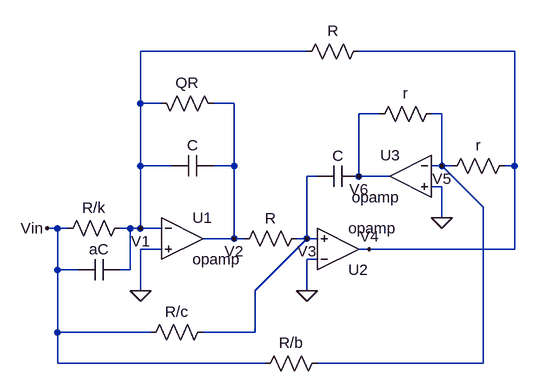
[diagram p0: schematic Ackberg_Mossberg _modificada.asc]
Ackberg_Mossberg _modificada.asc, the LTspice schematic file:
Version 4
SHEET 1 880 680
WIRE 304 -64 48 -64
WIRE 624 -64 384 -64
WIRE 48 16 48 -64
WIRE 80 16 48 16
WIRE 192 16 160 16
WIRE 416 32 384 32
WIRE 512 32 496 32
WIRE 48 112 48 16
WIRE 96 112 48 112
WIRE 192 112 192 16
WIRE 192 112 160 112
WIRE 512 112 512 32
WIRE 512 112 496 112
WIRE 528 112 512 112
WIRE 624 112 624 -64
WIRE 624 112 608 112
WIRE 320 128 304 128
WIRE 384 128 384 32
WIRE 432 128 384 128
WIRE 512 144 496 144
WIRE 576 176 512 112
WIRE 512 192 512 144
WIRE -80 208 -96 208
WIRE -64 208 -80 208
WIRE 32 208 16 208
WIRE 48 208 48 112
WIRE 48 208 32 208
WIRE 80 208 48 208
WIRE 192 224 192 112
WIRE 192 224 144 224
WIRE 208 224 192 224
WIRE 304 224 304 128
WIRE 304 224 288 224
WIRE 320 224 304 224
WIRE 80 240 48 240
WIRE 400 240 384 240
WIRE 624 240 624 112
WIRE 624 240 400 240
WIRE 320 256 304 256
WIRE -80 272 -80 208
WIRE -48 272 -80 272
WIRE 32 272 32 208
WIRE 32 272 16 272
WIRE 48 304 48 240
WIRE 224 304 304 224
WIRE 304 304 304 256
WIRE -80 368 -80 272
WIRE 64 368 -80 368
WIRE 224 368 224 304
WIRE 224 368 144 368
WIRE -80 416 -80 368
WIRE 240 416 -80 416
WIRE 576 416 576 176
WIRE 576 416 320 416
FLAG 304 304 0
FLAG 48 304 0
FLAG -96 208 Vin
FLAG 48 208 V1
FLAG 192 224 V2
FLAG 304 224 V3
FLAG 400 240 V4
FLAG 512 192 0
FLAG 512 112 V5
FLAG 384 128 V6
SYMBOL res 32 192 R90
WINDOW 0 0 56 VBottom 2
WINDOW 3 32 56 VTop 2
SYMATTR InstName R/k
SYMATTR Value ""
SYMBOL Opamps\\opamp 112 160 R0
SYMATTR InstName U1
SYMBOL res 64 0 M90
WINDOW 0 0 56 VBottom 2
WINDOW 3 32 56 VTop 2
SYMATTR InstName QR
SYMATTR Value ""
SYMBOL cap 96 96 M90
WINDOW 0 0 32 VBottom 2
WINDOW 3 32 32 VTop 2
SYMATTR InstName C
SYMATTR Value ""
SYMBOL res 304 208 R90
WINDOW 0 0 56 VBottom 2
WINDOW 3 32 56 VTop 2
SYMATTR InstName R
SYMATTR Value ""
SYMBOL Opamps\\opamp 352 304 M180
SYMATTR InstName U2
SYMBOL cap 384 112 R90
WINDOW 0 0 32 VBottom 2
WINDOW 3 32 32 VTop 2
SYMATTR InstName C
SYMATTR Value ""
SYMBOL res 400 -80 R90
WINDOW 0 0 56 VBottom 2
WINDOW 3 32 56 VTop 2
SYMATTR InstName R
SYMATTR Value ""
SYMBOL Opamps\\opamp 464 64 M0
SYMATTR InstName U3
SYMBOL res 624 96 R90
WINDOW 0 0 56 VBottom 2
WINDOW 3 32 56 VTop 2
SYMATTR InstName r
SYMATTR Value ""
SYMBOL res 512 16 R90
WINDOW 0 0 56 VBottom 2
WINDOW 3 32 56 VTop 2
SYMATTR InstName r
SYMATTR Value ""
SYMBOL cap 16 256 R90
WINDOW 0 0 32 VBottom 2
WINDOW 3 28 32 VBottom 2
SYMATTR InstName aC
SYMATTR Value ""
SYMBOL res 160 352 R90
WINDOW 0 0 56 VBottom 2
WINDOW 3 32 56 VTop 2
SYMATTR InstName R/c
SYMATTR Value ""
SYMBOL res 336 400 R90
WINDOW 0 0 56 VBottom 2
WINDOW 3 32 56 VTop 2
SYMATTR InstName R/b
SYMATTR Value ""

The netlist it stands for:
* Ackberg_Mossberg _modificada.asc
R/k V1 Vin
XU1 V1 0 V2 opamp Aol=100K GBW=10Meg  ; pins invin noninvin out
R§QR V1 V2
C V1 V2
R V3 V2
XU2 0 V3 V4 opamp Aol=100K GBW=10Meg  ; pins invin noninvin out
C V6 V3
R V4 V1
XU3 V5 0 V6 opamp Aol=100K GBW=10Meg  ; pins invin noninvin out
r V4 V5
r V5 V6
C§aC V1 Vin
R/c V3 Vin
R/b V5 Vin
.backanno
.end